# Altium schematic sheet Sheet1.SchDoc
size A
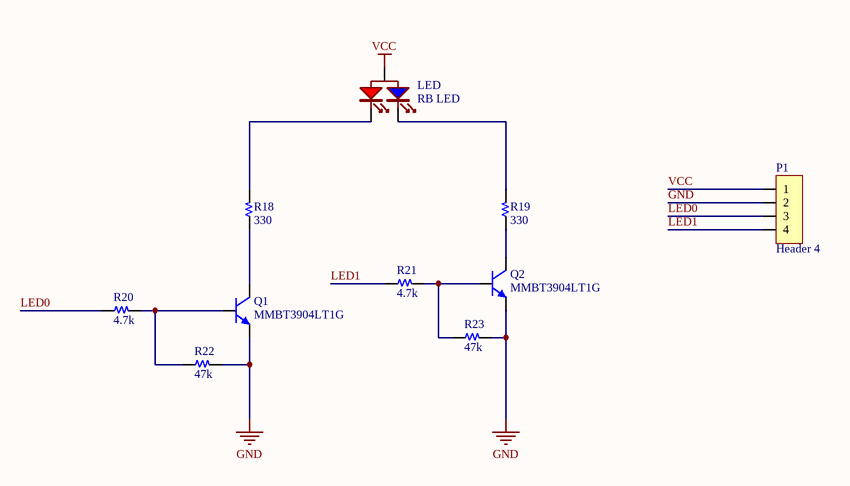
[diagram p0: Sheet1.SchDoc]

## Parts
LED  RB LED  [LED-BICOLOR-3MM]
P1  Header 4  [HDR/Header/4/BOX/RED]
Q1  MMBT3904LT1G  [SOT-23]
Q2  MMBT3904LT1G  [SOT-23]
R18  330  [R 0603]
R19  330  [R 0603]
R20  4.7k  [R 0603]
R21  4.7k  [R 0603]
R22  47k  [R 0603]
R23  47k  [R 0603]

## Nets
GND: P1.2 Q1.2(E) Q2.2(E) R22.2 R23.2
VCC: LED.2(A) P1.1
LED0: P1.3 R20.1
LED1: P1.4 R21.1
NetLED_1: LED.1(K1) R18.2
NetLED_3: LED.3(K2) R19.2
NetQ1_1: Q1.1(B) R20.2 R22.1
NetQ1_3: Q1.3(C) R18.1
NetQ2_1: Q2.1(B) R21.2 R23.1
NetQ2_3: Q2.3(C) R19.1

## Library data of the parts
LED = LED 2-color-A: Bicolor RB 3mm LED
P1 = Header 4: Header, 4-Pin
Q1 Q2 = Transistor NPN: NPN Bipolar Transistor
R18-R23 = Resistor